# EAGLE design 2022国技館遠隔非常停止回路 (EAGLE 9.6.2)
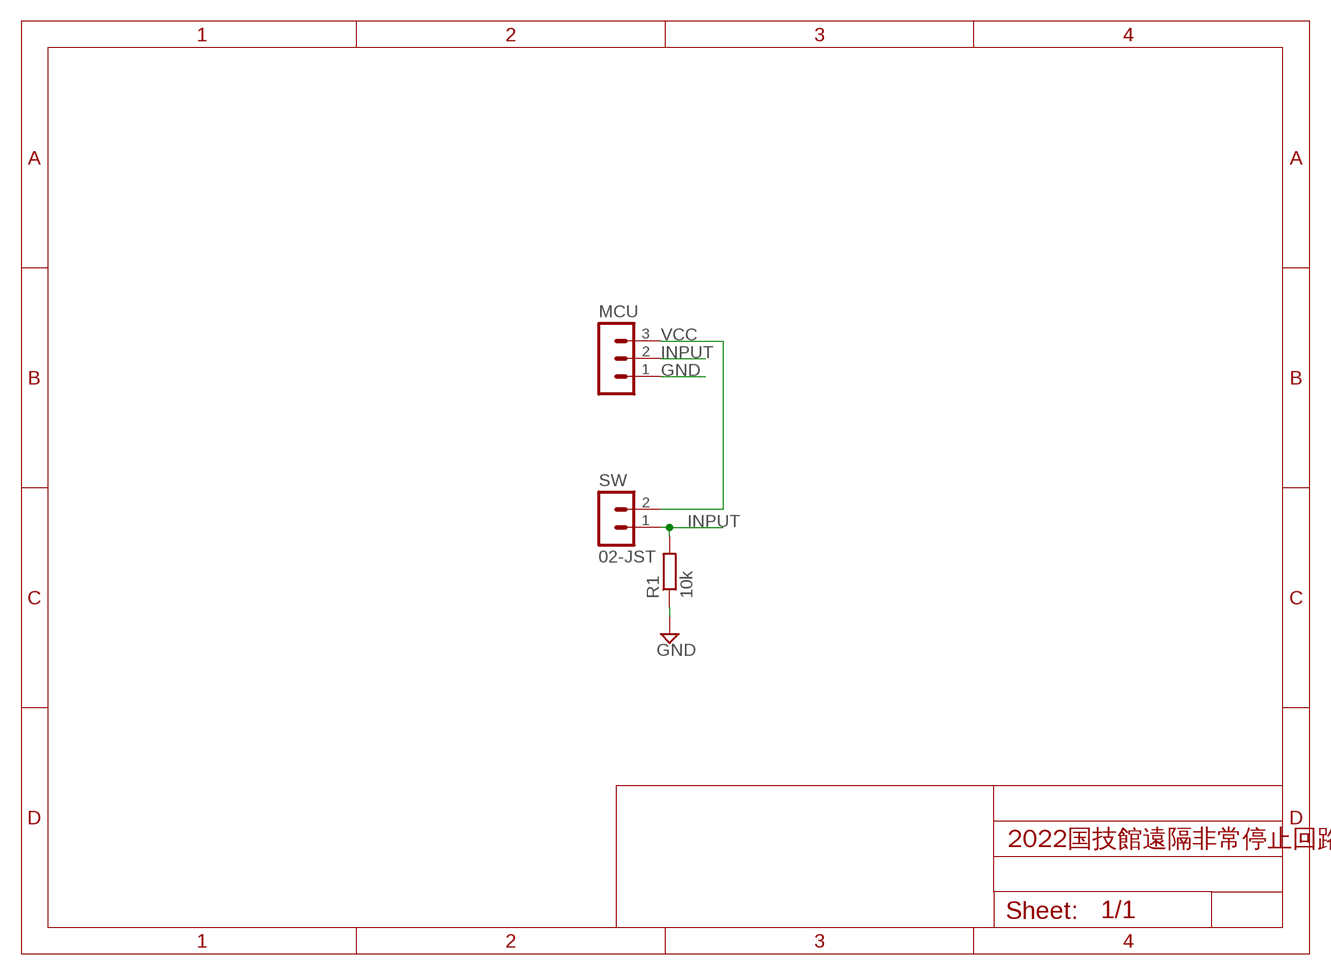
[diagram p0: schematic, sheet 1]

## Parts
MCU  03-JST  [B3B-XH]
R1  10k  R-EU_0204/7  [0204/7]
SW  02-JST  [B2B-XH]

## Nets
GND: MCU.1 R1.1
INPUT: MCU.2 R1.2 SW.1
VCC: MCU.3 SW.2

## Library data of the parts
MCU = con-jst-xh:03-JST: JST CONNECTOR
R1 = rcl:R-EU_: RESISTOR, European symbol; SPICEPREFIX: R
SW = con-jst-xh:02-JST: JST CONNECTOR

## Board
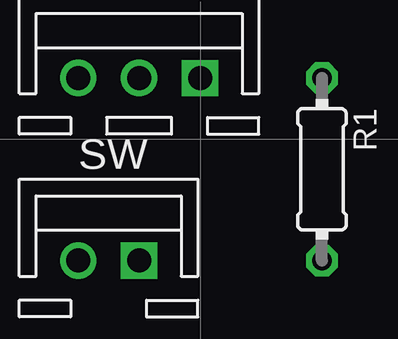
[diagram p1: board, top side]
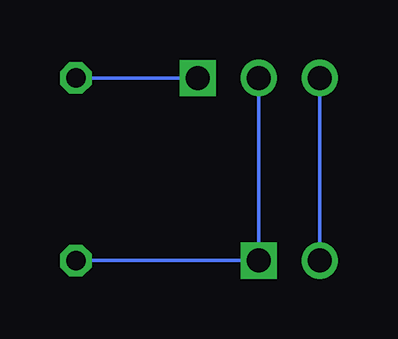
[diagram p2: board, bottom side, seen from below]

No outline drawn. Coordinates in mm, seen from the top.
Copper layers (1*16): Top 0.035mm / dielectric 1.5mm / Bottom 0.035mm
Design rules "default": minimum track width 6mil, minimum drill 0.35mm, track to track 6mil, track to pad 6mil, pad to pad 6mil, via to via 6mil, smd to smd 6mil, copper to edge 40mil, drill to drill 6mil, minimum pad ring 10mil, minimum via ring 8mil, stop-mask expansion 4mil, vias tented up to drill 0mil, thermal gap 10mil

### Footprints (pad centres in the part's own frame; a part is rotated, then mirrored left to right if it is on the bottom)
B3B-XH = drill 1 square: 1 2.54,0 | drill 1: 2 0,0; 3 -2.54,0
0204/7 = drill 0.813 octagon: 1 -3.81,0; 2 3.81,0
B2B-XH = drill 1 square: 1 1.27,0 | drill 1: 2 -1.27,0

### Placement (x,y rotation side)
MCU  10.16,40.64 0 top
R1  17.78,36.83 270 top
SW  8.89,33.02 0 top
U$1  [TYPE.C]  0,0 0 top

### Tracks (layer width: path | path; a pad name or v marks a point on that pad's centre or on a via)
GND
  Bottom 0.152: R1.1 MCU.1
INPUT
  Bottom 0.152: MCU.2 SW.1 R1.2
VCC
  Bottom 0.152: MCU.3 SW.2